# EAGLE design ir-pcb (EAGLE 9.6.2)
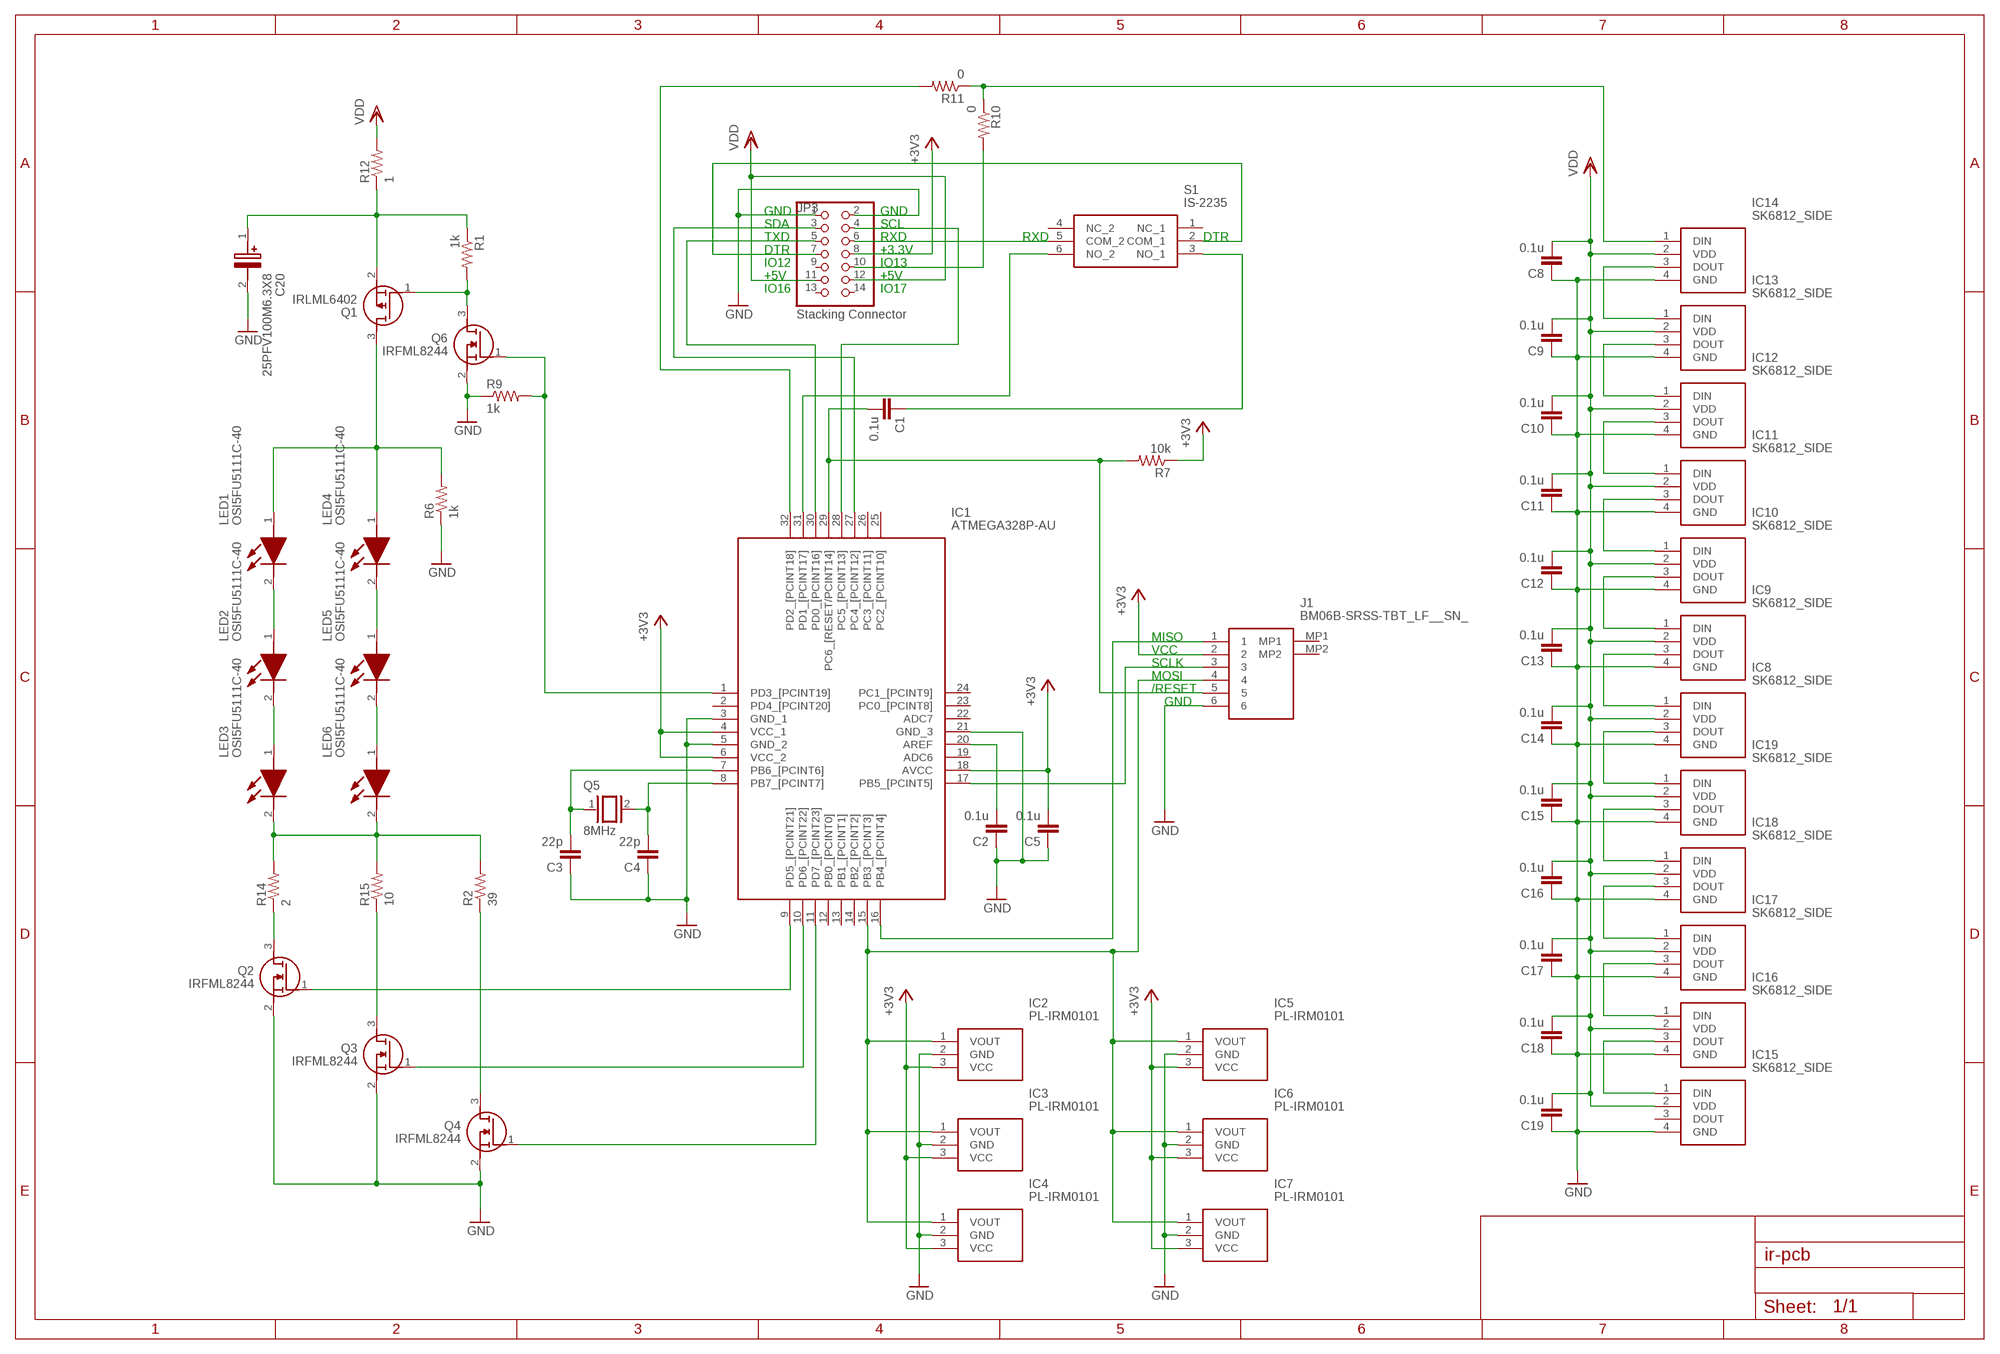
[diagram p0: schematic, sheet 1]

## Parts
C1  0.1u  C-EUC0603  [C0603]
C2  0.1u  C-EUC0603  [C0603]
C3  22p  C-EUC0603  [C0603]
C4  22p  C-EUC0603  [C0603]
C5  0.1u  C-EUC0603  [C0603]
C8  0.1u  C-EUC0603  [C0603]
C9  0.1u  C-EUC0603  [C0603]
C10  0.1u  C-EUC0603  [C0603]
C11  0.1u  C-EUC0603  [C0603]
C12  0.1u  C-EUC0603  [C0603]
C13  0.1u  C-EUC0603  [C0603]
C14  0.1u  C-EUC0603  [C0603]
C15  0.1u  C-EUC0603  [C0603]
C16  0.1u  C-EUC0603  [C0603]
C17  0.1u  C-EUC0603  [C0603]
C18  0.1u  C-EUC0603  [C0603]
C19  0.1u  C-EUC0603  [C0603]
C20  25PFV100M6.3X8  [CAPAE660X800N]
IC1  ATMEGA328P-AU  [QFP80P900X900X120-32N]
IC2  PL-IRM0101  [TO254P525X740X825-3P]
IC3  PL-IRM0101  [TO254P525X740X825-3P]
IC4  PL-IRM0101  [TO254P525X740X825-3P]
IC5  PL-IRM0101  [TO254P525X740X825-3P]
IC6  PL-IRM0101  [TO254P525X740X825-3P]
IC7  PL-IRM0101  [TO254P525X740X825-3P]
IC8  SK6812_SIDE  [SK6812SIDE]
IC9  SK6812_SIDE  [SK6812SIDE]
IC10  SK6812_SIDE  [SK6812SIDE]
IC11  SK6812_SIDE  [SK6812SIDE]
IC12  SK6812_SIDE  [SK6812SIDE]
IC13  SK6812_SIDE  [SK6812SIDE]
IC14  SK6812_SIDE  [SK6812SIDE]
IC15  SK6812_SIDE  [SK6812SIDE]
IC16  SK6812_SIDE  [SK6812SIDE]
IC17  SK6812_SIDE  [SK6812SIDE]
IC18  SK6812_SIDE  [SK6812SIDE]
IC19  SK6812_SIDE  [SK6812SIDE]
J1  BM06B-SRSS-TBT_LF__SN_  [BM06BSRSSTBTLFSN]
JP3  Stacking Connector  PINHD-2X7  [2X07]
LED1  OSI5FU5111C-40  [OSI5FU5111C40]
LED2  OSI5FU5111C-40  [OSI5FU5111C40]
LED3  OSI5FU5111C-40  [OSI5FU5111C40]
LED4  OSI5FU5111C-40  [OSI5FU5111C40]
LED5  OSI5FU5111C-40  [OSI5FU5111C40]
LED6  OSI5FU5111C-40  [OSI5FU5111C40]
Q1  IRLML6402  [SOT95P237X112-3N]
Q2  IRFML8244  [SOT95P237X112-3N]
Q3  IRFML8244  [SOT95P237X112-3N]
Q4  IRFML8244  [SOT95P237X112-3N]
Q5  8MHz  XTAL/S  [QS]
Q6  IRFML8244  [SOT95P237X112-3N]
R1  1k  R-US_R0603  [R0603]
R2  39  R-US_R2512W  [R2512W]
R6  1k  R-US_R0603  [R0603]
R7  10k  R-US_R0603  [R0603]
R9  1k  R-US_R0603  [R0603]
R10  0  R-US_R0603  [R0603]
R11  0  R-US_R0603  [R0603]
R12  1  R-US_R2512W  [R2512W]
R14  2  R-US_R2512W  [R2512W]
R15  10  R-US_R2512W  [R2512W]
S1  IS-2235  [IS2235]

## Nets
+3V3 [POWER]: C5.2 IC1.4(VCC_1) IC1.6(VCC_2) IC1.18(AVCC) IC2.3(VCC) IC3.3(VCC) IC4.3(VCC) IC5.3(VCC) IC6.3(VCC) IC7.3(VCC) J1.2 JP3.8 R7.1
GND [LEDPOWER]: C2.1 C3.1 C4.1 C5.1 C8.1 C9.1 C10.1 C11.1 C12.1 C13.1 C14.1 C15.1 C16.1 C17.1 C18.1 C19.1 C20.2(-) IC1.3(GND_1) IC1.5(GND_2) IC1.21(GND_3) IC2.2(GND) IC3.2(GND) IC4.2(GND) IC5.2(GND) IC6.2(GND) IC7.2(GND) IC8.4(GND) IC9.4(GND) IC10.4(GND) IC11.4(GND) IC12.4(GND) IC13.4(GND) IC14.4(GND) IC15.4(GND) IC16.4(GND) IC17.4(GND) IC18.4(GND) IC19.4(GND) J1.6 JP3.1 JP3.2 Q2.2(S) Q3.2(S) Q4.2(S) Q6.2(S) R6.1 R9.1
LED1 [POWER]: LED1.1(A) LED4.1(A) Q1.3(D) R6.2
LED2 [POWER]: C20.1(+) Q1.2(S) R1.1 R12.1
LED3 [POWER]: LED4.2(K) LED5.1(A)
LED4 [POWER]: LED1.2(K) LED2.1(A)
LED5 [POWER]: LED5.2(K) LED6.1(A)
LED6 [POWER]: LED2.2(K) LED3.1(A)
LED7 [POWER]: LED3.2(K) LED6.2(K) R2.2 R14.2 R15.2
LED8 [POWER]: Q2.3(D) R14.1
LED9 [POWER]: Q3.3(D) R15.1
LED10 [POWER]: Q4.3(D) R2.1
N$1: IC1.16(PB4_[PCINT4]) J1.1
N$2: Q1.1(G) Q6.3(D) R1.2
N$3: JP3.6 S1.5(COM_2)
N$5: IC1.17(PB5_[PCINT5]) J1.3
N$10: IC1.1(PD3_[PCINT19]) Q6.1(G) R9.2
N$11: IC8.1(DIN) IC9.3(DOUT)
N$13: C2.2 IC1.20(AREF)
N$14: JP3.7 S1.2(COM_1)
N$18: IC1.9(PD5_[PCINT21]) Q2.1(G)
N$19: IC1.10(PD6_[PCINT22]) Q3.1(G)
N$20: IC1.11(PD7_[PCINT23]) Q4.1(G)
N$21: IC1.28(PC5_[PCINT13]) JP3.4
N$22: C3.2 IC1.7(PB6_[PCINT6]) Q5.1
N$23: IC1.30(PD0_[PCINT16]) JP3.5
N$24: IC13.1(DIN) IC14.3(DOUT)
N$25: C1.2 IC1.29(PC6_[RESET/PCINT14]) J1.5 R7.2
N$26: C4.2 IC1.8(PB7_[PCINT7]) Q5.2
N$28: C1.1 S1.3(NO_1)
N$29: IC1.31(PD1_[PCINT17]) S1.6(NO_2)
N$30: IC1.27(PC4_[PCINT12]) JP3.3
N$31: IC12.1(DIN) IC13.3(DOUT)
N$32: IC11.1(DIN) IC12.3(DOUT)
N$33: IC10.1(DIN) IC11.3(DOUT)
N$34: IC9.1(DIN) IC10.3(DOUT)
N$36: IC8.3(DOUT) IC19.1(DIN)
N$37: IC18.1(DIN) IC19.3(DOUT)
N$38: IC17.1(DIN) IC18.3(DOUT)
N$39: IC16.1(DIN) IC17.3(DOUT)
N$40: IC15.1(DIN) IC16.3(DOUT)
N$41: IC1.15(PB3_[PCINT3]) IC2.1(VOUT) IC3.1(VOUT) IC4.1(VOUT) IC5.1(VOUT) IC6.1(VOUT) IC7.1(VOUT) J1.4
N$42: JP3.10 R10.2
N$43: IC1.32(PD2_[PCINT18]) R11.2
N$44: IC14.1(DIN) R10.1 R11.1
VDD [LEDPOWER]: C8.2 C9.2 C10.2 C11.2 C12.2 C13.2 C14.2 C15.2 C16.2 C17.2 C18.2 C19.2 IC8.2(VDD) IC9.2(VDD) IC10.2(VDD) IC11.2(VDD) IC12.2(VDD) IC13.2(VDD) IC14.2(VDD) IC15.2(VDD) IC16.2(VDD) IC17.2(VDD) IC18.2(VDD) IC19.2(VDD) JP3.11 JP3.12 R12.2
Unconnected: IC1.2(PD4_[PCINT20]) IC1.12(PB0_[PCINT0]) IC1.13(PB1_[PCINT1]) IC1.14(PB2_[PCINT2]) IC1.19(ADC6) IC1.22(ADC7) IC1.23(PC0_[PCINT8]) IC1.24(PC1_[PCINT9]) IC1.25(PC2_[PCINT10]) IC1.26(PC3_[PCINT11]) IC15.3(DOUT) J1.MP1 J1.MP2 JP3.9 JP3.13 JP3.14 S1.1(NC_1) S1.4(NC_2)

## Notes on the sheet
- GND | GND
- SDA | SCL
- TXD | RXD | RXD | DTR
- DTR | +3.3V
- IO12 | IO13
- +5V | +5V
- IO16 | IO17
- MISO
- VCC
- SCLK
- MOSI
- /RESET
- GND

## Library data of the parts
C1-C5 C8-C19 = rcl:C-EU: CAPACITOR, European symbol; SPICEPREFIX: C
C20 = SamacSys_Parts:25PFV100M6.3X8: Aluminum Organic Polymer Capacitors HIGH TEMP HYBRID CAPACITOR Source: Datasheet <https://componentsearchengine.com/Datasheets/1/25PFV100M6.3X8.pdf>; DESCRIPTION: Aluminum Organic Polymer Capacitors HIGH TEMP HYBRID CAPACITOR; HEIGHT: 8mm; MANUFACTURER_NAME: Rubycon; MANUFACTURER_PART_NUMBER: 25PFV100M6.3X8; MOUSER_PART_NUMBER: 232-25PFV100M6.3X8; MOUSER_PRICE-STOCK: https://www.mouser.co.uk/ProductDetail/Rubycon/25PFV100M6.3X8?qs=T3oQrply3y8JF6DDLdeIPA%3D%3D
IC1 = SamacSys_Parts:ATMEGA328P-AU: MICROCHIP - ATMEGA328P-AU. - MICROCONTROLLER MCU, 8 BIT, ATMEGA, 20MHZ, TQFP-32 Source: Datasheet <https://componentsearchengine.com/Datasheets/2/ATMEGA328P-AU.pdf>; ARROW_PART_NUMBER: ATMEGA328P-AU; ARROW_PRICE-STOCK: https://www.arrow.com/en/products/atmega328p-au/microchip-technology?region=nac; DESCRIPTION: MICROCHIP - ATMEGA328P-AU. - MICROCONTROLLER MCU, 8 BIT, ATMEGA, 20MHZ, TQFP-32; HEIGHT: 1.2mm; MANUFACTURER_NAME: Microchip; MANUFACTURER_PART_NUMBER: ATMEGA328P-AU; MOUSER_PART_NUMBER: 556-ATMEGA328P-AU; MOUSER_PRICE-STOCK: https://www.mouser.co.uk/ProductDetail/Microchip-Technology-Atmel/ATMEGA328P-AU?qs=K8BHR703ZXiCmmgp6%2FGNmQ%3D%3D
IC2-IC7 = SamacSys_Parts:PL-IRM0101: INFRARED REMOTE CONTROL RECEIVER MODULE Source: Datasheet <http://akizukidenshi.com/download/ds/paralight/DS-27-01-0001 PL-IRM0101-3 B1.pdf>; DESCRIPTION: INFRARED REMOTE CONTROL RECEIVER MODULE; HEIGHT: 5.25mm; MANUFACTURER_NAME: Para Light Electronics; MANUFACTURER_PART_NUMBER: PL-IRM0101
IC8-IC19 = SamacSys_Parts:SK6812_SIDE: SK6812 SIDE/SK6805 SIDE is a smart LED control circuit Source: Datasheet <https://drive.google.com/file/d/1ogB9Ikb2NH7tOdPVDoBaHqeA7tHurhhe/view?usp=sharing>; DESCRIPTION: SK6812 SIDE/SK6805 SIDE is a smart LED control circuit; HEIGHT: 2.05mm; MANUFACTURER_NAME: Shenzhen Normand Electronic; MANUFACTURER_PART_NUMBER: SK6812 SIDE
J1 = SamacSys_Parts:BM06B-SRSS-TBT_LF__SN_: Conn Shrouded Header HDR 6 POS 1mm Solder ST SMD T/R Source: Datasheet <http://www.jst-mfg.com/product/pdf/eng/eSH.pdf>; ARROW_PART_NUMBER: BM06B-SRSS-TBT(LF)(SN); ARROW_PRICE-STOCK: https://www.arrow.com/en/products/bm06b-srss-tbt-lf-sn/jst-manufacturing; DESCRIPTION: Conn Shrouded Header HDR 6 POS 1mm Solder ST SMD T/R; HEIGHT: 4.25mm; MANUFACTURER_NAME: JST (JAPAN SOLDERLESS TERMINALS); MANUFACTURER_PART_NUMBER: BM06B-SRSS-TBT(LF)(SN)
JP3 = pinhead:PINHD-2X7: PIN HEADER
LED1-LED6 = SamacSys_Parts:OSI5FU5111C-40: 5mm Round Infared LED Source: Datasheet <http://akizukidenshi.com/download/OSI5FU5111C-40.pdf>; DESCRIPTION: 5mm Round Infared LED; HEIGHT: 8.7mm; MANUFACTURER_NAME: OptoSupply; MANUFACTURER_PART_NUMBER: OSI5FU5111C-40
Q1 = SamacSys_Parts:IRLML6402: P-Channel MOSFET Transistor, 3.7 A, 20 V, 3-Pin SOT-23 International Rectifier IRLML6402 Source: Datasheet <https://datasheetspdf.com/pdf/513015/InternationalRectifier/IRLML6402/1>; DESCRIPTION: P-Channel MOSFET Transistor, 3.7 A, 20 V, 3-Pin SOT-23 International Rectifier IRLML6402; HEIGHT: 1.12mm; MANUFACTURER_NAME: Infineon; MANUFACTURER_PART_NUMBER: IRLML6402; MOUSER_PART_NUMBER: N/A; MOUSER_PRICE-STOCK: https://www.mouser.co.uk/ProductDetail/Infineon-IR/IRLML6402?qs=Gkr2N%2F2q3o277qI%252BRzUP%252Bw%3D%3D
Q2-Q4 Q6 = SamacSys_Parts:IRFML8244: HEXFET Power MOSFET 25V Source: Datasheet <https://datasheet.datasheetarchive.com/originals/dk/DKDS-31/601026.pdf>; DESCRIPTION: HEXFET Power MOSFET 25V; HEIGHT: 1.12mm; MANUFACTURER_NAME: Infineon; MANUFACTURER_PART_NUMBER: IRFML8244; MOUSER_PART_NUMBER: N/A; MOUSER_PRICE-STOCK: https://www.mouser.co.uk/ProductDetail/Infineon-Technologies/IRFML8244?qs=bAKSY%2FctAC4ez%2FysLA2f0A%3D%3D
Q5 = special:XTAL/S: CRYSTAL
R1 R2 R6 R7 R9-R12 R14 R15 = rcl:R-US_: RESISTOR, American symbol; SPICEPREFIX: R
S1 = SamacSys_Parts:IS-2235: Tiny Slide Switch, 2P2T Source: Datasheet <http://www.switronic.com/gallery/detail/400>; DESCRIPTION: Tiny Slide Switch, 2P2T; HEIGHT: 5mm; MANUFACTURER_NAME: Switronic; MANUFACTURER_PART_NUMBER: IS-2235

## Net classes
1 POWER: width 0.508 mm
2 LEDPOWER: width 0.61 mm

## Board
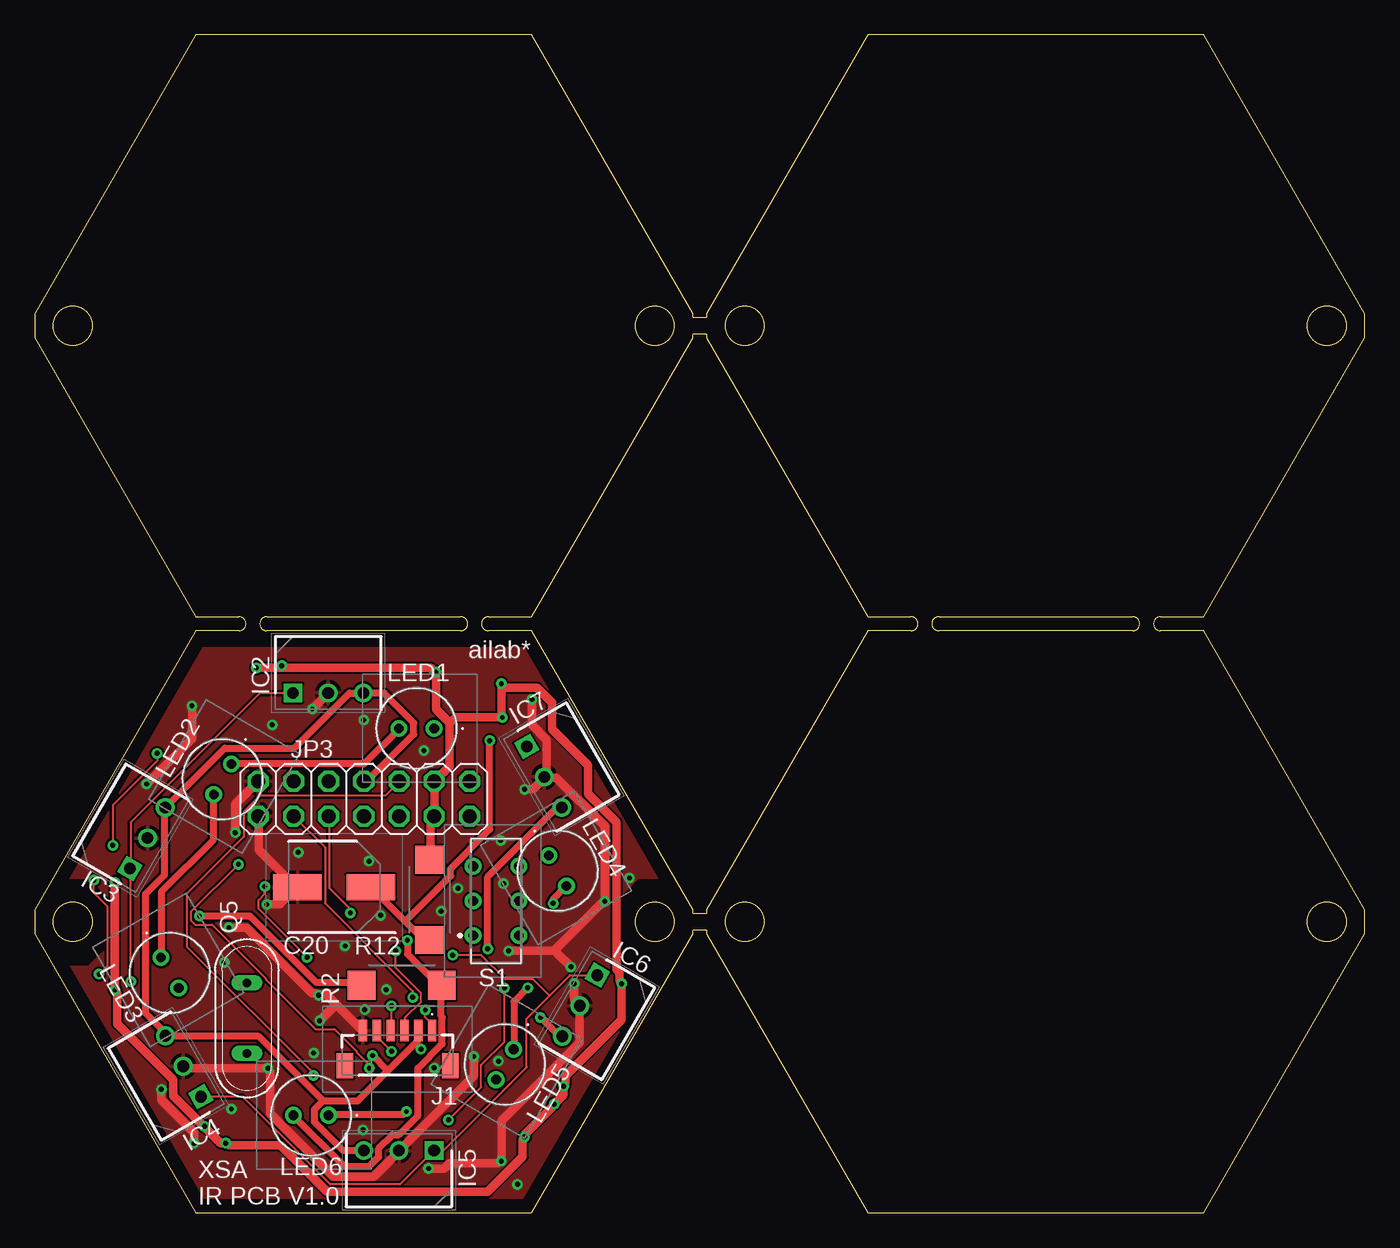
[diagram p1: board, top side]
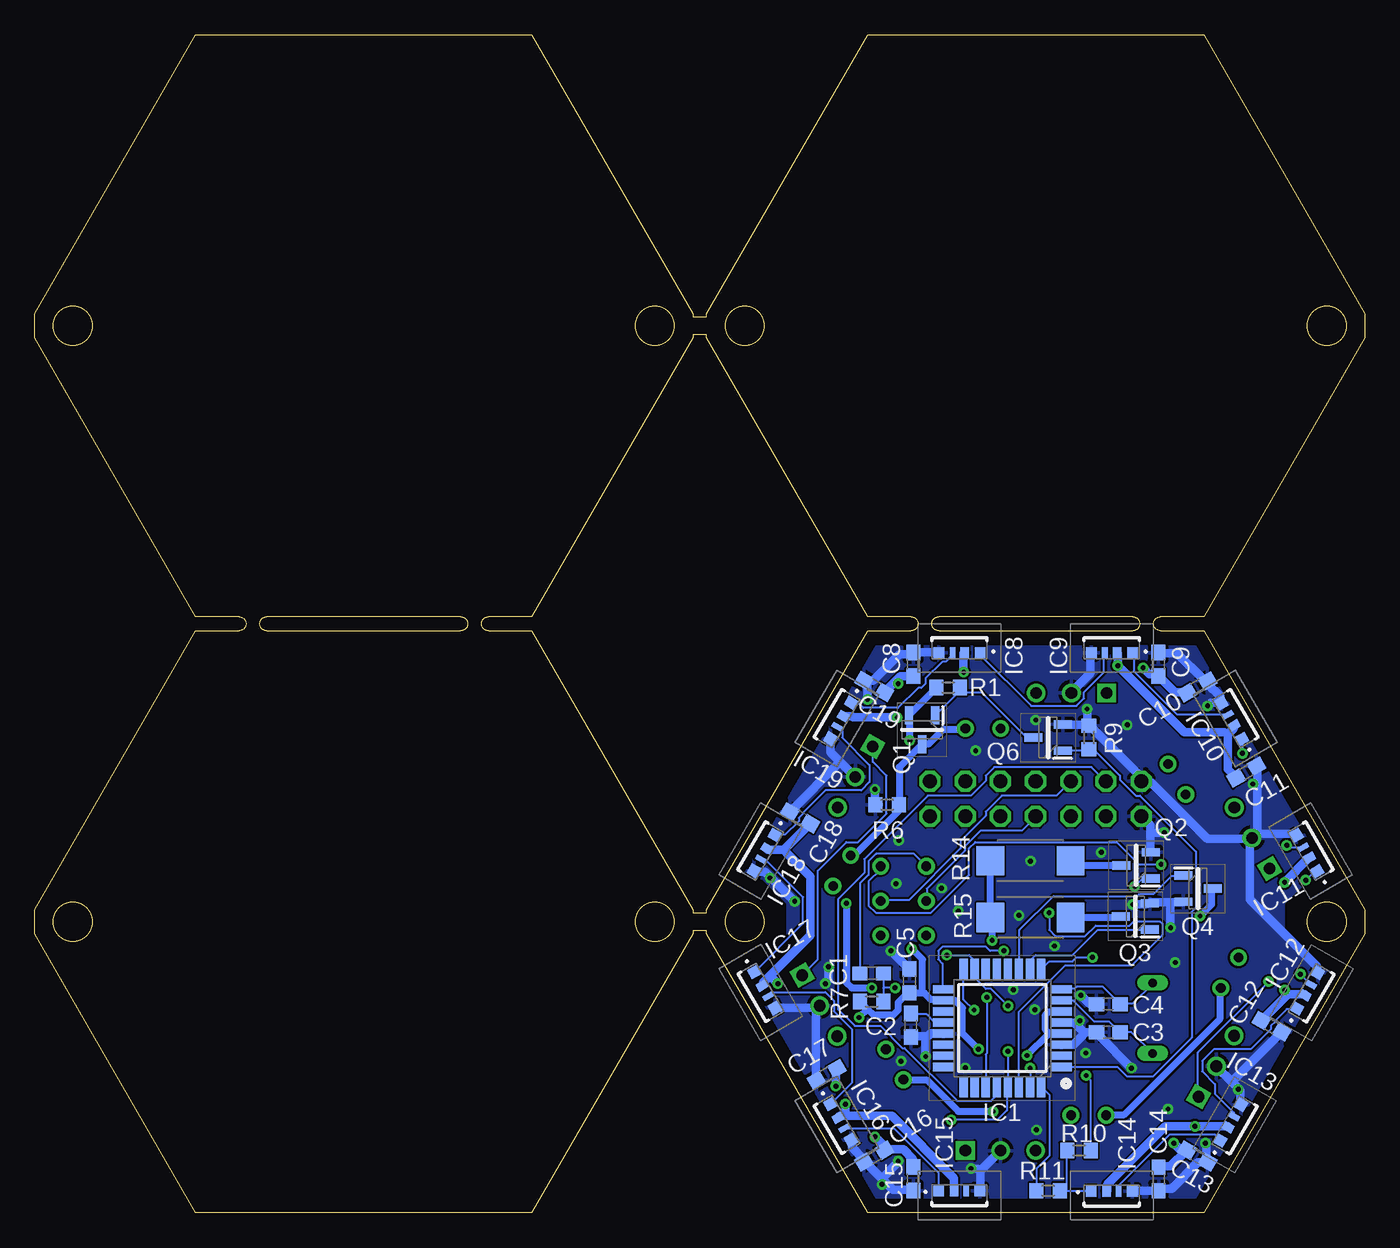
[diagram p2: board, bottom side, seen from below]

Size 96 x 85 mm. Coordinates in mm from the lower left corner, seen from the top.
Outline: 16.75,43 arc180 16.75,42 30.75,42 arc180 30.75,43 16.75,43
Outline: 14.75,42 arc180 14.75,43 11.63,43 0,63.14 0,64.86 11.63,85 35.87,85 47.5,64.86 47.5,64.6 48.5,64.6 48.5,64.86 60.13,85 84.37,85 96,64.86 96,63.14 84.37,43 81.25,43 arc180 81.25,42 84.37,42 96,21.86 96,20.14 84.37,0 60.13,0 48.5,20.14 48.5,20.4 47.5,20.4 47.5,20.14 35.87,0 11.63,0 0,20.14 0,21.86 11.63,42 14.75,42
Outline: 60.13,43 63.25,43 arc-180 63.25,42 60.13,42 48.5,21.86 48.5,21.6 47.5,21.6 47.5,21.86 35.87,42 32.75,42 arc-180 32.75,43 35.87,43 47.5,63.14 47.5,63.4 48.5,63.4 48.5,63.14 60.13,43
Outline: 65.25,43 79.25,43 arc-180 79.25,42 65.25,42 arc-180 65.25,43
Outline: circle at 93.25,64 radius 1.4
Outline: circle at 51.25,64 radius 1.4
Outline: circle at 44.75,64 radius 1.4
Outline: circle at 2.75,64 radius 1.4
Outline: circle at 93.25,21 radius 1.4
Outline: circle at 51.25,21 radius 1.4
Outline: circle at 44.75,21 radius 1.4
Outline: circle at 2.75,21 radius 1.4
Copper layers (1*16): Top 0.035mm / dielectric 1.5mm / Bottom 0.035mm
Design rules "default": minimum track width 6mil, minimum drill 0.35mm, track to track 6mil, track to pad 6mil, pad to pad 6mil, via to via 6mil, smd to smd 6mil, copper to edge 40mil, drill to drill 6mil, minimum pad ring 10mil, minimum via ring 8mil, stop-mask expansion 4mil, vias tented up to drill 0mil, thermal gap 10mil

### Footprints (pad centres in the part's own frame; a part is rotated, then mirrored left to right if it is on the bottom)
C0603 = smd 1.1 x 1: 1 -0.85,0; 2 0.85,0
CAPAE660X800N = smd 3.5 x 1.85: 1 -2.65,0; 2 2.65,0
QFP80P900X900X120-32N = smd 1.5 x 0.6: 1 -4.25,2.8; 2 -4.25,2; 3 -4.25,1.2; 4 -4.25,0.4; 5 -4.25,-0.4; 6 -4.25,-1.2; 7 -4.25,-2; 8 -4.25,-2.8; 17 4.25,-2.8; 18 4.25,-2; 19 4.25,-1.2; 20 4.25,-0.4; 21 4.25,0.4; 22 4.25,1.2; 23 4.25,2; 24 4.25,2.8 | smd 0.6 x 1.5: 9 -2.8,-4.25; 10 -2,-4.25; 11 -1.2,-4.25; 12 -0.4,-4.25; 13 0.4,-4.25; 14 1.2,-4.25; 15 2,-4.25; 16 2.8,-4.25; 25 2.8,4.25; 26 2,4.25; 27 1.2,4.25; 28 0.4,4.25; 29 -0.4,4.25; 30 -1.2,4.25; 31 -2,4.25; 32 -2.8,4.25
TO254P525X740X825-3P = drill 0.84 pad 1.26 square: 1 0,0 | drill 0.84 pad 1.26: 2 2.54,0; 3 5.08,0
SK6812SIDE = smd 0.75 x 0.8: 1 -1.505,0.325 | smd 0.6 x 0.8: 2 -0.38,0.325 | smd 0.4 x 0.8: 3 0.5,0.325 | smd 0.8 x 0.8: 4 1.48,0.325
BM06BSRSSTBTLFSN = smd 0.6 x 1.55: 1 -2.5,-1.612; 2 -1.5,-1.612; 3 -0.5,-1.612; 4 0.5,-1.612; 5 1.5,-1.612; 6 2.5,-1.612 | smd 1.2 x 1.8: MP1 -3.8,0.912; MP2 3.8,0.912
2X07 = drill 1.016 octagon: 1 -7.62,-1.27; 2 -7.62,1.27; 3 -5.08,-1.27; 4 -5.08,1.27; 5 -2.54,-1.27; 6 -2.54,1.27; 7 0,-1.27; 8 0,1.27; 9 2.54,-1.27; 10 2.54,1.27; 11 5.08,-1.27; 12 5.08,1.27; 13 7.62,-1.27; 14 7.62,1.27
OSI5FU5111C40 = drill 0.7 pad 1.2: 1 0,0; 2 2.54,0
SOT95P237X112-3N = smd 1.3 x 0.6: 1 -1.05,0.95; 2 -1.05,-0.95; 3 1.05,0
QS = drill 0.61 long: 1 -2.54,0; 2 2.54,0
R0603 = smd 1 x 1.1: 1 -0.85,0; 2 0.85,0
R2512W = smd 2 x 2.1: 1 -2.896,0; 2 2.896,0
IS2235 = drill 0.7 pad 1.2: 1 -2.5,1.65; 2 0,1.65; 3 2.5,1.65; 4 -2.5,-1.65; 5 0,-1.65; 6 2.5,-1.65

### Placement (x,y rotation side)
C1  35.59,17.27 0 bottom
C2  32.77,13.54 90 bottom
C3  18.52,13.03 0 bottom
C4  18.52,15.06 0 bottom
C5  32.87,16.74 270 bottom
C8  32.59,39.57 270 bottom
C9  14.91,39.57 270 bottom
C10  12.09,37.95 210 bottom
C11  8.56,31.8 210 bottom
C12  6.73,13.46 150 bottom
C13  12.09,4.09 150 bottom
C14  14.88,2.44 90 bottom
C15  32.59,2.46 90 bottom
C16  35.41,4.09 30 bottom
C17  38.84,9.98 30 bottom
C18  40.77,28.5 330 bottom
C19  35.41,37.97 330 bottom
C20  21.62,23.5 180 top
IC1  26.16,13.34 180 bottom
IC2  18.64,37.52 0 top
IC3  6.88,24.84 60 top
IC4  11.99,8.38 120 top
IC5  28.83,4.5 180 top
IC6  40.61,17.14 240 top
IC7  35.51,33.66 300 top
IC8  29.26,40.74 180 bottom
IC9  18.26,40.74 180 bottom
IC10  9.35,35.66 120 bottom
IC11  3.91,26.11 120 bottom
IC12  3.86,15.88 60 bottom
IC13  9.4,6.35 60 bottom
IC14  18.26,1.24 0 bottom
IC15  29.26,1.27 0 bottom
IC16  38.1,6.38 300 bottom
IC17  43.59,15.9 300 bottom
IC18  43.61,26.11 240 bottom
IC19  38.1,35.66 240 bottom
J1  26.19,11.53 180 top
JP3  23.76,29.88 0 top
LED1  28.83,34.95 180 top
LED2  14.2,32.38 240 top
LED3  9.12,18.41 300 top
LED4  37.11,25.78 300 top
LED5  34.57,11.81 240 top
LED6  21.21,7.04 180 top
Q1  31.95,34.85 270 bottom
Q2  16.51,25.07 180 bottom
Q3  16.56,21.39 180 bottom
Q4  12.04,23.39 0 bottom
Q5  15.32,14.05 90 top
Q6  22.86,34.29 180 bottom
R1  30.07,37.9 0 bottom
R2  26.49,16.41 0 top
R6  34.47,29.44 0 bottom
R7  35.59,15.24 0 bottom
R9  19.91,34.29 270 bottom
R10  20.62,4.5 0 bottom
R11  22.86,1.6 180 bottom
R12  28.52,22.58 90 top
R14  24.13,25.4 180 bottom
R15  24.13,21.31 180 bottom
S1  33.3,22.5 90 top

### Tracks (layer width: path | path; a pad name or v marks a point on that pad's centre or on a via)
+3V3  (via drill 0.35)
  Top 0.508: v32.69,19.05 32.69,24.23 37.64,29.18 38.02,29.18 IC7.3 | v36.5,14.1 37.8,12.8 38.02,12.8 IC6.3 | JP3.8 23.77,31.17 24,31.17 27.36,34.52 27.36,35.36 25.22,37.49 23.77,37.49 IC2.3 23.47,37.49 22.71,37.49 18.75,33.53 13.72,33.53 9.6,29.41 IC3.3 9.37,29.18 9.37,24.38 8,23.01 8,14.4 9.37,13.03 IC4.3 9.45,12.72 16.15,12.72 20.8,8.08 | 25.49,10.25 23.32,8.08 20.8,8.08 | 25.49,10.25 27.47,12.23 | 27.47,12.23 27.66,12.42 27.66,13.11 J1.2 | 20.8,8.08 20.19,7.47 20.19,6.55 22.25,4.5 IC5.3 | 25.49,10.25 v24.38,11.35 | 27.47,12.23 v27.89,11.81
  Bottom 0.508: 31.93,15.85 31.77,15.85 31.32,15.39 30.48,15.39 IC1.18 30.18,15.32 29.57,15.32 29.03,14.78 29.03,12.95 v27.89,11.81 | 31.93,15.85 32.84,15.85 C5.2 33.07,15.77 33.68,15.16 33.68,14.63 34.06,14.25 35.43,14.25 35.89,14.71 | 35.89,14.71 36.42,15.24 R7.1 | v32.69,19.05 31.93,18.29 31.93,15.85 | 35.89,14.71 v36.5,14.1 | 22.78,12.95 21.95,12.95 IC1.4 | 22.78,12.95 23.09,13.26 23.09,14.25 22.86,14.48 21.95,14.48 IC1.6 | v24.38,11.35 22.78,12.95
GND  (via drill 0.35)
  Top 0.61: v16.76,22.25 17.68,22.25 18.9,23.47 C20.2 18.67,23.7 16.15,26.21 16.15,28.57 JP3.1 | v20.04,36.35 21.18,37.49 IC2.2 | v14.48,27.43 14.48,29.49 16.08,31.09 JP3.2 | v11.35,36.58 11.35,34.21 v8.08,30.94 | IC7.2 36.8,31.39 37.64,31.39 41.15,27.89 v41.15,22.48 40.92,22.33 37.49,18.9 | 37.49,18.9 v34.21,18.9 | v35.36,30.56 35.97,30.56 36.58,31.17 IC7.2 | v35.89,37.03 35.89,35.2 36.96,34.14 36.96,31.7 IC7.2 | v31.7,11.28 31.7,9.91 IC5.2 26.14,4.27 24.46,2.59 21.57,2.59 16.99,7.16 16.99,10.21 v16.84,10.44 10.82,10.44 10.74,10.52 IC4.2 | 21.75,15.05 23.62,13.18 J1.6 | 21.75,15.05 21.11,15.7 v20.5,15.7 20.27,15.85 20.04,15.85 15.32,20.57 v14.02,20.57 | 21.75,15.05 v20.57,13.87 | v11.51,5.03 11.51,5.79 9.14,8.15 v9.14,8.91 | v28.42,3.2 29.57,3.2 29.95,3.58 33.45,3.58 v33.68,3.73 33.68,6.63 39.32,12.27 39.32,14.94 IC6.2 39.09,15.16 38.94,15.32 v38.94,16.54 | v38.71,17.75 37.72,18.75 37.49,18.9
  Bottom 0.61: 15.47,27.43 15.47,27.96 16.08,28.57 JP3.1 | 15.47,27.43 15.47,26.06 Q2.2 | 14.02,22.4 13.11,22.4 Q4.2 | 14.02,22.4 15.47,22.4 Q3.2 15.77,22.25 v16.76,22.25 | IC9.4 19.81,40.39 19.81,38.94 21.18,37.57 IC2.2 | R9.1 19.96,35.2 21.79,35.2 Q6.2 | R9.1 19.66,34.98 16.15,31.47 16.15,31.17 JP3.2 15.85,31.09 15.47,31.09 11.35,26.98 8.53,26.98 IC3.2 | v20.04,36.35 20.04,35.51 R9.1 | v14.48,27.43 15.47,27.43 | C9.1 14.86,40.39 13.56,40.39 11.66,38.48 C10.1 11.35,38.33 11.35,38.18 10.44,37.26 10.44,36.8 IC10.4 10.74,36.8 11.12,36.8 v11.35,36.58 | IC12.4 3.43,17.37 3.43,17.75 8.31,22.63 8.31,26.82 8.15,26.98 IC3.2 | IC11.4 4.95,27.28 5.18,27.28 5.26,27.36 7.77,27.36 7.92,27.2 IC3.2 | 7.77,30.94 7.77,27.58 IC3.2 | 7.77,30.94 7.77,32.16 C11.1 | v8.08,30.94 7.77,30.94 | IC8.4 30.79,40.46 32.54,40.46 C8.1 32.84,40.31 33.6,40.31 35.51,38.41 36.12,38.41 C19.1 35.89,38.18 v35.89,37.03 | v41.15,22.48 43.28,24.61 44.04,24.61 IC18.4 | 37.87,32.54 36.8,31.47 IC7.2 | 37.87,32.54 38.56,33.22 IC19.4 | v34.21,18.9 32.92,17.6 C5.1 | 37.87,32.54 41.45,28.96 C18.1 | v35.36,30.56 35.36,29.49 R6.1 | IC16.4 37.03,5.18 37.03,4.72 36.2,3.89 36.2,3.73 C16.1 35.89,3.5 34.86,2.48 | 34.86,2.48 34.06,1.68 32.61,1.68 C15.1 | IC17.4 42.52,14.78 39.55,14.78 39.4,14.94 IC6.2 39.62,14.55 39.62,9.6 C17.1 | 34.86,2.48 33.68,3.66 v33.68,3.73 | 31.7,12.72 31.55,12.72 31.32,12.95 30.48,12.95 IC1.21 | 31.7,12.72 32.77,12.72 C2.1 | 27.74,3.05 27.74,1.6 IC15.4 | IC5.2 27.74,3.05 | v31.7,11.28 31.7,12.72 | 20.27,13.03 C3.1 19.2,12.8 v16.84,10.44 | 20.84,13.6 20.95,13.72 21.87,13.72 IC1.5 | 20.84,13.6 20.27,13.03 | IC1.3 21.87,12.12 21.03,12.12 20.34,12.8 20.27,13.03
  Bottom 0.61: v20.5,15.7 19.89,15.09 19.43,15.09 C4.1 | v20.57,13.87 20.84,13.6 | IC14.4 16.76,1.6 14.94,1.6 C14.1 14.63,1.75 13.95,1.75 12.04,3.66 11.43,3.66 C13.1 11.43,3.96 11.43,4.95 v11.51,5.03 | 8.99,8.84 8.99,7.85 IC13.4 | 9.6,9.45 10.67,10.52 IC4.2 | 9.6,9.45 8.99,8.84 | 9.6,9.45 6.02,13.03 C12.1 | v9.14,8.91 8.99,8.84 | v28.42,3.2 27.96,3.2 27.74,3.05 | v38.71,17.75 38.71,16.76 v38.94,16.54 | v14.02,20.57 14.02,22.4
  other vias: 22.4,19.25 24.97,21.46 24.13,25.37 19.02,26.01 25.37,16.1 23.83,14.66 28.83,10.46 30.56,23.42 33.83,23.75 33.63,26.87 28.09,33.35 23.75,35.56 17.14,35.2 20.14,11.53 13.69,18.06 23.7,5.99 14.2,7.49 34.85,2.06 42.93,24.16 33.48,10.95 29.34,21.77
  pour Bottom: 10.83,40.87 36.53,40.87 46.53,24.16 43.49,24.14 41.71,22.35 41.71,19.48 43.4,17.79 46.15,17.81 35.84,0 11.61,0 1.22,17.87 3.93,17.78 5.81,19.67 5.83,22.32 4.03,24.12 1.27,24.13
  pour Top: 10.78,40.77 36.58,40.77 46.54,24.13 43.56,24.13 41.68,22.25 41.68,19.61 43.52,17.77 46.1,17.75 35.86,0 11.63,-0.03 1.27,17.78 3.91,17.78 5.84,19.71 5.84,22.25 3.96,24.13 1.27,24.13
LED1
  Bottom 0.508: LED1.1 28.88,34.9 30.4,34.9 31.47,33.83 31.7,33.83 Q1.3 32,33.76 33.6,32.16 33.6,29.49 R6.2 33.6,29.18 33.6,29.03 36.8,25.83 37.11,25.83 LED4.1
LED2  (via drill 0.35)
  Top 0.508: 26.75,21.03 24.31,23.47 C20.1 | 26.75,21.03 28.04,19.74 28.5,19.74 R12.1 | v32.84,34.06 32.84,27.66 30.02,24.84 30.02,24.31 26.75,21.03
  Bottom 0.508: R1.1 30.94,37.87 32.84,35.97 Q1.2 32.84,35.66 v32.84,34.06
LED3  (via drill 0.35)
  Top 0.508: v35.59,16.23 34.59,15.24 34.59,11.81 LED5.1 | v37.41,22.33 37.41,22.63 38.33,23.55 LED4.2
  Bottom 0.508: v35.59,16.23 37.03,16.23 37.41,16.61 v37.41,22.33
LED4
  Top 0.508: LED2.1 23.77,32.38 26.29,34.9 LED1.2
LED5  (via drill 0.35)
  Top 0.508: v26.82,7.32 26.59,7.09 21.26,7.09 LED6.1
  Bottom 0.508: v26.82,7.32 29.34,7.32 31.62,9.6 LED5.2
LED6
  Top 0.508: LED3.1 9.14,18.44 9.14,23.16 12.88,26.9 12.88,30.18 LED2.2
LED7  (via drill 0.35)
  Top 0.508: v26.9,19.66 26.9,18.67 29.11,16.46 29.34,16.46 R2.2 29.34,16.15 29.34,14.17 29.41,14.1 29.41,12.19 27.66,10.44 27.66,7.01 26.29,5.64 25.83,5.64 24.84,4.65 24.84,4.04 24.16,3.35 22.33,3.35 18.67,7.01 LED6.2
  Bottom 0.508: R14.2 27.05,25.38 27.05,21.34 R15.2 26.9,21.11 v26.9,19.66 | LED3.2 10.44,16.15 10.44,14.02 17.37,7.09 18.67,7.09 LED6.2
LED8
  Bottom 0.508: Q2.3 20.88,25.07 21.18,25.38 R14.1
LED9
  Bottom 0.508: Q3.3 17.68,21.34 21.18,21.34 R15.1
LED10  (via drill 0.35)
  Top 0.508: v11.89,21.41 15.54,21.41 20.34,16.61 23.39,16.61 23.55,16.46 R2.1
  Bottom 0.508: v11.89,21.41 11.05,22.25 11.05,23.39 Q4.3
N$1  (via drill 0.35)
  Top 0.152: v28.19,14.63 28.19,14.1 28.65,13.64 28.65,13.18 J1.1
  Bottom 0.152: v28.19,14.63 28.96,15.39 28.96,17.53 IC1.16
N$2
  Bottom 0.152: Q1.1 30.94,35.97 29.26,37.64 29.26,37.87 R1.2 29.26,37.57 27.66,37.57 24.38,34.29 Q6.3
N$3
  Bottom 0.152: S1.5 34.9,22.55 32.92,22.55 29.18,26.29 29.18,26.82 27.36,28.65 27.36,28.96 26.21,30.1 22.25,30.1 21.26,31.09 JP3.6
N$5  (via drill 0.35)
  Top 0.152: v26.06,18.9 26.06,17.68 27.89,15.85 27.89,15.24 26.75,14.1 26.75,13.18 J1.3
  Bottom 0.152: v26.06,18.9 27.05,18.9 27.36,19.2 30.48,19.2 30.79,18.9 30.79,18.29 30.48,17.98 30.48,16.15 IC1.17
N$10
  Bottom 0.152: Q6.1 21.79,33.38 19.96,33.38 R9.2 19.89,33.38 19.51,33.38 17.68,31.55 17.68,31.24 16.54,30.1 16.23,30.1 12.19,26.06 12.19,22.02 12.5,21.72 12.5,12.65 15.32,9.83 17.14,9.83 17.83,10.52 21.87,10.52 IC1.1
N$11
  Bottom 0.152: IC9.3 18.82,40.39 18.82,39.01 20.27,37.57 20.27,37.11 20.8,36.58 24.08,36.58 27.74,40.23 27.74,40.39 IC8.1
N$13
  Bottom 0.152: C2.2 32.77,14.33 31.62,14.33 31.09,13.79 30.48,13.79 IC1.20
N$14
  Bottom 0.152: S1.2 31.62,22.55 31.62,23.39 28.88,26.14 28.88,26.44 27.74,27.58 24.77,27.58 23.77,28.57 JP3.7
N$18  (via drill 0.35)
  Top 0.152: v16.61,23.55 16.61,23.01 16.15,22.55 16.15,21.95 v19.66,18.44
  Bottom 0.152: v16.61,23.55 16.08,24.08 15.47,24.08 Q2.1 | v19.66,18.44 20.8,18.44 21.11,18.14 22.78,18.14 23.32,17.6 IC1.9
N$19
  Bottom 0.152: Q3.1 15.54,20.42 19.28,20.42 21.11,18.59 23.77,18.59 24.16,18.21 24.16,17.6 IC1.10
N$20
  Bottom 0.152: Q4.1 13.11,24.31 13.95,24.31 15.24,23.01 16.23,23.01 16.38,22.86 22.48,22.86 24.92,20.42 24.92,17.6 IC1.11
N$21
  Bottom 0.152: IC1.28 26.59,9.07 26.59,8.46 26.98,8.08 29.41,8.08 33.22,11.89 33.38,11.89 34.98,13.49 36.8,13.49 38.02,14.71 38.02,22.63 36.12,24.54 36.12,25.53 31.55,30.1 28.42,30.1 27.36,31.17 27.36,31.55 26.75,32.16 19.74,32.16 18.75,31.17 JP3.4
N$22
  Bottom 0.152: Q5.1 16.84,13.03 C3.2 18.44,13.79 19.51,13.79 21.03,15.32 21.87,15.32 IC1.7
N$23  (via drill 0.35)
  Top 0.152: v22.78,21.64 22.78,21.95 21.26,23.47 21.26,28.57 JP3.5
  Bottom 0.152: v22.78,21.64 22.78,20.42 22.33,19.96 20.19,19.96 19.43,20.73 16.99,20.73 16.69,21.03 14.78,21.03 14.63,20.88 14.63,20.04 16.84,17.83 21.64,17.83 24.99,14.48 24.99,9.14 IC1.30
N$24
  Bottom 0.152: IC14.3 17.75,1.6 17.75,1.98 14.1,5.64 10.82,5.64 10.44,5.26 IC13.1
N$25  (via drill 0.35)
  Top 0.152: v25.76,11.66 24.69,12.72 24.69,13.11 J1.5 | v33.91,16.23 33.91,12.34 32.23,10.67 32.23,9.07 v29.87,6.71
  Bottom 0.152: 34.75,16.23 34.75,17.22 C1.2 | 34.75,16.23 R7.2 | v25.76,11.66 25.76,9.14 IC1.29 25.83,9.07 25.83,7.39 26.52,6.71 v29.87,6.71 | v33.91,16.23 34.75,16.23
N$26
  Bottom 0.152: Q5.2 15.32,16.54 16.76,15.09 17.6,15.09 C4.2 17.68,15.09 18.9,16.31 20.8,16.31 20.95,16.15 21.87,16.15 IC1.8
N$28
  Bottom 0.152: C1.1 36.42,17.3 36.42,23.77 35.81,24.38 35.81,25.38 35.28,25.91 32.54,25.91 31.7,25.07 S1.3
N$29  (via drill 0.35)
  Top 0.152: v24.16,10.44 24.16,10.67 23.24,11.58 23.24,11.66 21.64,13.26 20.27,13.26 16.69,16.84 16.69,16.92 12.8,20.8 11.58,20.8 11.28,21.11 11.28,21.72 v14.71,25.15
  Bottom 0.152: v24.16,10.44 24.16,9.14 IC1.31 | v14.71,25.15 16.31,25.15 17.91,26.75 28.12,26.75 28.57,26.29 28.57,24.38 31.32,21.64 35.28,21.64 35.81,22.17 35.81,23.93 34.98,24.77 34.98,24.99 S1.6
N$30  (via drill 0.35)
  Top 0.152: v27.28,15.54 27.28,16 20.95,22.33 20.95,26.36 18.75,28.57 JP3.3
  Bottom 0.152: v27.28,15.54 27.28,11.51 27.36,11.43 27.36,9.14 IC1.27
N$31
  Bottom 0.152: IC13.3 9.45,7.01 9.45,7.24 10.82,8.61 10.82,9.3 11.73,10.21 11.73,10.97 10.9,11.81 8.23,11.81 6.78,13.26 6.78,13.49 6.48,13.79 6.48,13.87 5.64,14.71 4.95,14.71 IC12.1
N$32  (via drill 0.35)
  Top 0.152: v4.27,24 4.27,23.09 5.26,22.1 5.26,17.83 v4.65,17.22
  Bottom 0.152: v4.27,24 3.66,24.61 3.5,24.61 IC11.1 | v4.65,17.22 3.96,16.54 IC12.3
N$33  (via drill 0.35)
  Top 0.152: v5.64,26.52 5.64,29.41 8.84,32.61 v8.84,33.15
  Bottom 0.152: v5.64,26.52 5.49,26.36 4.5,26.36 IC11.3 | v8.84,33.15 8.84,34.14 IC10.1
N$34
  Bottom 0.152: IC10.3 9.91,35.97 13.56,35.97 16.69,39.09 16.69,40.39 IC9.1
N$36
  Bottom 0.152: IC19.1 37.03,36.73 36.5,36.73 36.2,36.42 33.68,36.42 32.23,37.87 32,37.87 31.7,38.18 31.7,38.56 30.48,39.78 30.25,39.78 29.79,40.23 29.79,40.39 IC8.3
N$37
  Bottom 0.152: IC18.1 42.52,27.28 41.83,27.28 40.84,28.27 40.84,28.5 40.54,28.8 40.54,28.88 38.94,30.48 36.35,30.48 35.74,31.09 35.74,32.31 37.72,34.29 37.72,34.75 38.02,35.05 IC19.3
N$38
  Bottom 0.152: IC18.3 43.51,25.45 43.2,25.45 40.54,22.78 40.54,20.88 44.04,17.37 IC17.1
N$39
  Bottom 0.152: IC16.1 38.56,7.85 37.03,9.37 37.03,13.26 38.33,14.55 38.33,15.32 38.94,15.93 42.82,15.93 43.05,15.7 IC17.3
N$40
  Bottom 0.152: IC15.1 30.79,1.6 30.79,2.9 33.98,6.1 IC16.3
N$41  (via drill 0.35)
  Top 0.152: 6.93,24.84 6.93,28.19 16.23,37.49 18.59,37.49 IC2.1 | v25.76,14.94 25.76,13.18 J1.4 | IC4.1 15.01,8.38 21.34,2.06 26.36,2.06 28.8,4.5 IC5.1 29.49,4.5 35.51,10.52 35.51,14.02 37.15,15.66 | IC6.1 38.63,17.14 37.15,15.66 | v30.18,18.59 32.23,18.59 33.98,16.84 35.97,16.84 37.15,15.66 | v6.93,16.69 6.93,24.84 | 6.93,24.84 IC3.1
  Bottom 0.152: v25.76,14.94 26.98,16.15 27.36,16.15 28.12,16.92 28.12,17.53 IC1.15 28.19,17.6 28.19,18.21 28.57,18.59 v30.18,18.59 | IC7.1 35.51,32.54 34.52,31.55 34.52,28.8 36.58,26.75 37.41,26.75 39.47,24.69 39.47,18.29 IC6.1 | v6.93,16.69 12.04,11.58 12.04,8.38 IC4.1
N$42  (via drill 0.35)
  Top 0.152: v20.12,9.91 20.12,10.06 10.97,19.2 10.97,23.01 15.09,27.13 15.09,28.96 16.23,30.1 25.3,30.1 26.29,31.09 JP3.10
  Bottom 0.152: v20.12,9.91 19.81,9.6 19.81,4.5 R10.2
N$43
  Bottom 0.152: R11.2 23.7,1.6 23.7,3.2 22.78,4.12 22.78,8.53 23.32,9.07 IC1.32
N$44
  Bottom 0.152: R11.1 21.49,1.6 | 21.49,1.6 19.81,1.6 IC14.1 | 21.49,1.6 21.49,4.5 R10.1
VDD  (via drill 0.35)
  Top 0.61: R12.2 28.57,25.53 28.57,28.35 28.8,28.57 JP3.11 28.88,28.88 28.88,30.86 JP3.12 28.88,31.17 29.95,32.23 29.95,35.36 | 29.95,35.36 28.96,36.35 v28.96,39.01 28.73,39.17 28.57,39.32 17.83,39.32 | 29.95,35.36 30.18,35.51 30.4,35.74 v33.76,35.74 33.68,35.97 v33.68,38.18 33.91,37.87 36.27,37.87 37.34,36.8 37.34,34.9 39.93,32.31 39.93,30.25 41.99,28.19 41.99,17.53 42.22,17.3 42.22,16.76 v42.37,16.54 42.37,13.95 38.33,9.91 38.33,9.37 v38.18,9.14 38.18,8.53 v37.49,7.85 37.34,7.62 35.36,5.64 v35.36,5.49 35.2,5.26 35.2,4.04 32.69,1.52 21.11,1.52 17.75,4.88 14.02,4.88 v13.79,5.03 13.41,5.03 12.23,6.21 | 17.83,39.32 v16,39.32 | v17.83,39.47 17.83,39.32 | v5.79,23.85 v5.79,16.08 5.94,15.85 5.94,13.64 9.98,9.6 9.98,8.46 12.23,6.21 | v12.27,6.25 12.23,6.21
  Bottom 0.61: 9.91,34.52 9.45,34.98 9.45,35.13 IC10.2 | 9.91,34.52 9.91,32 9.3,31.39 C11.2 | IC9.2 17.83,40.39 v17.83,39.47 13.03,34.67 10.13,34.67 9.91,34.52 | C10.2 12.88,37.57 13.72,37.57 14.86,38.71 C9.2 15.16,38.86 15.54,38.86 v16,39.32 | 33.87,38.37 34.67,37.57 C19.2 | 33.87,38.37 33.53,38.71 32.61,38.71 C8.2 | v28.96,39.01 28.96,40.39 IC8.2 | v33.76,35.74 36.96,35.74 37.03,35.81 37.57,35.81 IC19.2 | v33.68,38.18 33.87,38.37 | IC14.2 18.59,1.6 18.59,2.06 14.4,6.25 v12.27,6.25 9.91,6.25 IC13.2 | C14.2 14.86,3.35 14.02,3.35 12.88,4.5 C13.2 13.26,4.5 v13.79,5.03 | 5.56,15.77 4.34,15.77 IC12.2 | 5.56,15.77 7.39,13.95 C12.2 | v5.79,23.85 4.04,25.6 IC11.2 | v5.79,16.08 5.71,16 5.56,15.77 | 41.91,26.21 43.13,26.21 IC18.2 | 41.91,26.21 40.08,28.04 C18.2 | 42.94,17.11 40.01,20.04 40.01,24.23 41.76,25.98 41.91,26.21 | 42.94,17.11 43.43,16.61 43.43,16.46 IC17.2 | C15.2 32.61,3.35 32.61,3.89 33.3,4.57 34.67,4.57 C16.2 34.75,4.88 v35.36,5.49 | 37.49,7.01 37.87,7.01 37.95,6.93 IC16.2 | 37.49,7.01 34.14,7.01 29.64,2.52 IC15.2 | v38.18,9.14 38.18,10.36 C17.2 | 37.49,7.01 v37.49,7.85 | v42.37,16.54 42.94,17.11

### Text on the board
tNames: ailab* | XSA / IR PCB V1.0